# EAGLE design untitled (EAGLE 9.0.0)

## Sheet 1 of 2
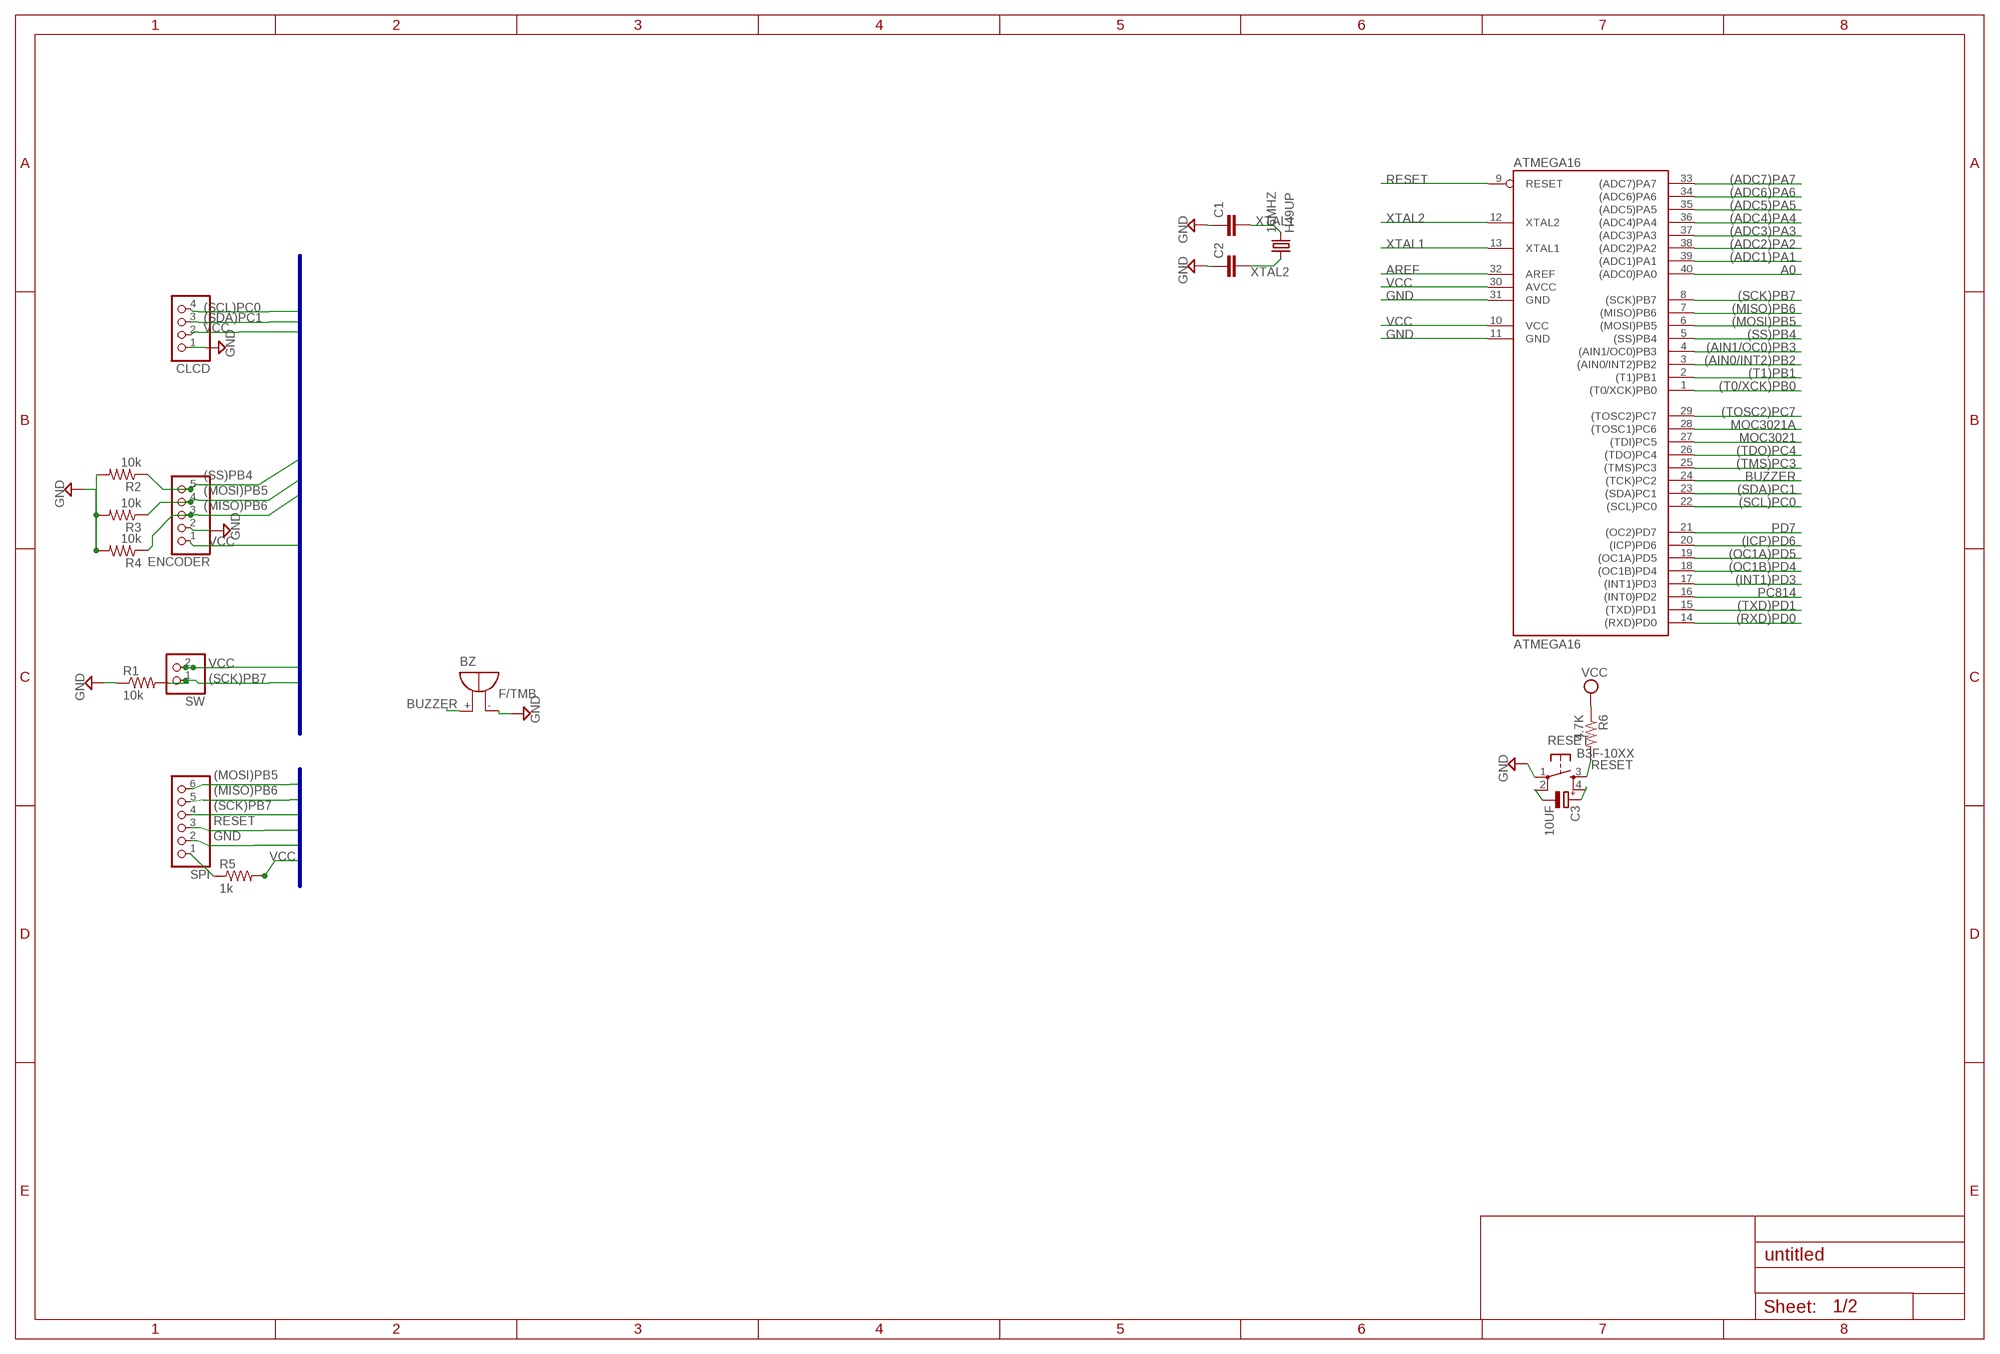
[diagram p0: schematic, sheet 1]

### Parts
16MHZ  H49UP  [XTAL1170X490X450N]
ATMEGA16  ATMEGA16  MEGA32-P  [DIL40]
BZ  F/TMB  [F/TMB]
C1  C-EU025-024X044  [C025-024X044]
C2  C-EU025-024X044  [C025-024X044]
C3  10UF  CPOL-EUE5-5  [E5-5]
CLCD  PINHD-1X4  [1X04]
ENCODER  PINHD-1X5  [1X05]
R1  10k  R-US_0204/7  [0204/7]
R2  10k  R-US_0204/7  [0204/7]
R3  10k  R-US_0204/7  [0204/7]
R4  10k  R-US_0204/7  [0204/7]
R5  1k  R-US_0204/7  [0204/7]
R6  4.7K  R-US_0204/7  [0204/7]
RESET  B3F-10XX  [B3F-10XX]
SPI  PINHD-1X6  [1X06]
SW  PINHD-1X2  [1X02]

### Nets
(ADC1)PA1: ATMEGA16.39((ADC1)PA1)
(ADC2)PA2: ATMEGA16.38((ADC2)PA2)
(ADC3)PA3: ATMEGA16.37((ADC3)PA3)
(ADC4)PA4: ATMEGA16.36((ADC4)PA4)
(ADC5)PA5: ATMEGA16.35((ADC5)PA5)
(ADC6)PA6: ATMEGA16.34((ADC6)PA6)
(ADC7)PA7: ATMEGA16.33((ADC7)PA7)
(AIN0/INT2)PB2: ATMEGA16.3((AIN0/INT2)PB2)
(AIN1/OC0)PB3: ATMEGA16.4((AIN1/OC0)PB3)
(ICP)PD6: ATMEGA16.20((ICP)PD6)
(INT1)PD3: ATMEGA16.17((INT1)PD3)
(MISO)PB6: ATMEGA16.7((MISO)PB6) ENCODER.3 R4.1 SPI.5
(MOSI)PB5: ATMEGA16.6((MOSI)PB5) ENCODER.4 R3.1 SPI.6
(OC1A)PD5: ATMEGA16.19((OC1A)PD5)
(OC1B)PD4: ATMEGA16.18((OC1B)PD4)
(RXD)PD0: ATMEGA16.14((RXD)PD0)
(SCK)PB7: ATMEGA16.8((SCK)PB7) R1.2 SPI.4 SW.1
(SCL)PC0: ATMEGA16.22((SCL)PC0) CLCD.4
(SDA)PC1: ATMEGA16.23((SDA)PC1) CLCD.3
(SS)PB4: ATMEGA16.5((SS)PB4) ENCODER.5 R2.1
(T0/XCK)PB0: ATMEGA16.1((T0/XCK)PB0)
(T1)PB1: ATMEGA16.2((T1)PB1)
(TDO)PC4: ATMEGA16.26((TDO)PC4)
(TMS)PC3: ATMEGA16.25((TMS)PC3)
(TOSC2)PC7: ATMEGA16.29((TOSC2)PC7)
(TXD)PD1: ATMEGA16.15((TXD)PD1)
A0: ATMEGA16.40((ADC0)PA0) ; also sheet 2
AREF: ATMEGA16.32(AREF)
BUZZER: ATMEGA16.24((TCK)PC2) BZ.+
GND: ATMEGA16.11(GND) ATMEGA16.31(GND) BZ.- C1.1 C2.1 CLCD.1 ENCODER.2 R1.1 R2.2 R3.2 R4.2 RESET.1(P) SPI.2 ; also sheet 2
MOC3021: ATMEGA16.27((TDI)PC5) ; also sheet 2
MOC3021A: ATMEGA16.28((TOSC1)PC6) ; also sheet 2
N$1: R5.1 SPI.1
N$2: C3.- RESET.2(P1)
N$3: C3.+ RESET.4(S1)
PC814: ATMEGA16.16((INT0)PD2) ; also sheet 2
PD7: ATMEGA16.21((OC2)PD7)
RESET: ATMEGA16.9(RESET) R6.2 RESET.3(S) SPI.3
VCC: ATMEGA16.10(VCC) ATMEGA16.30(AVCC) CLCD.2 ENCODER.1 R5.2 R6.1 SW.2 ; also sheet 2
XTAL1: 16MHZ.2 ATMEGA16.13(XTAL1) C1.2
XTAL2: 16MHZ.1 ATMEGA16.12(XTAL2) C2.2

### Buses
(MISO)PB6,(MOSI)PB5,(SCK)PB7,(SCL)PC0,(SDA)PC1,(SS)PB4,VCC
(MISO)PB6,(MOSI)PB5,(SCK)PB7,GND,RESET,VCC

## Sheet 2 of 2
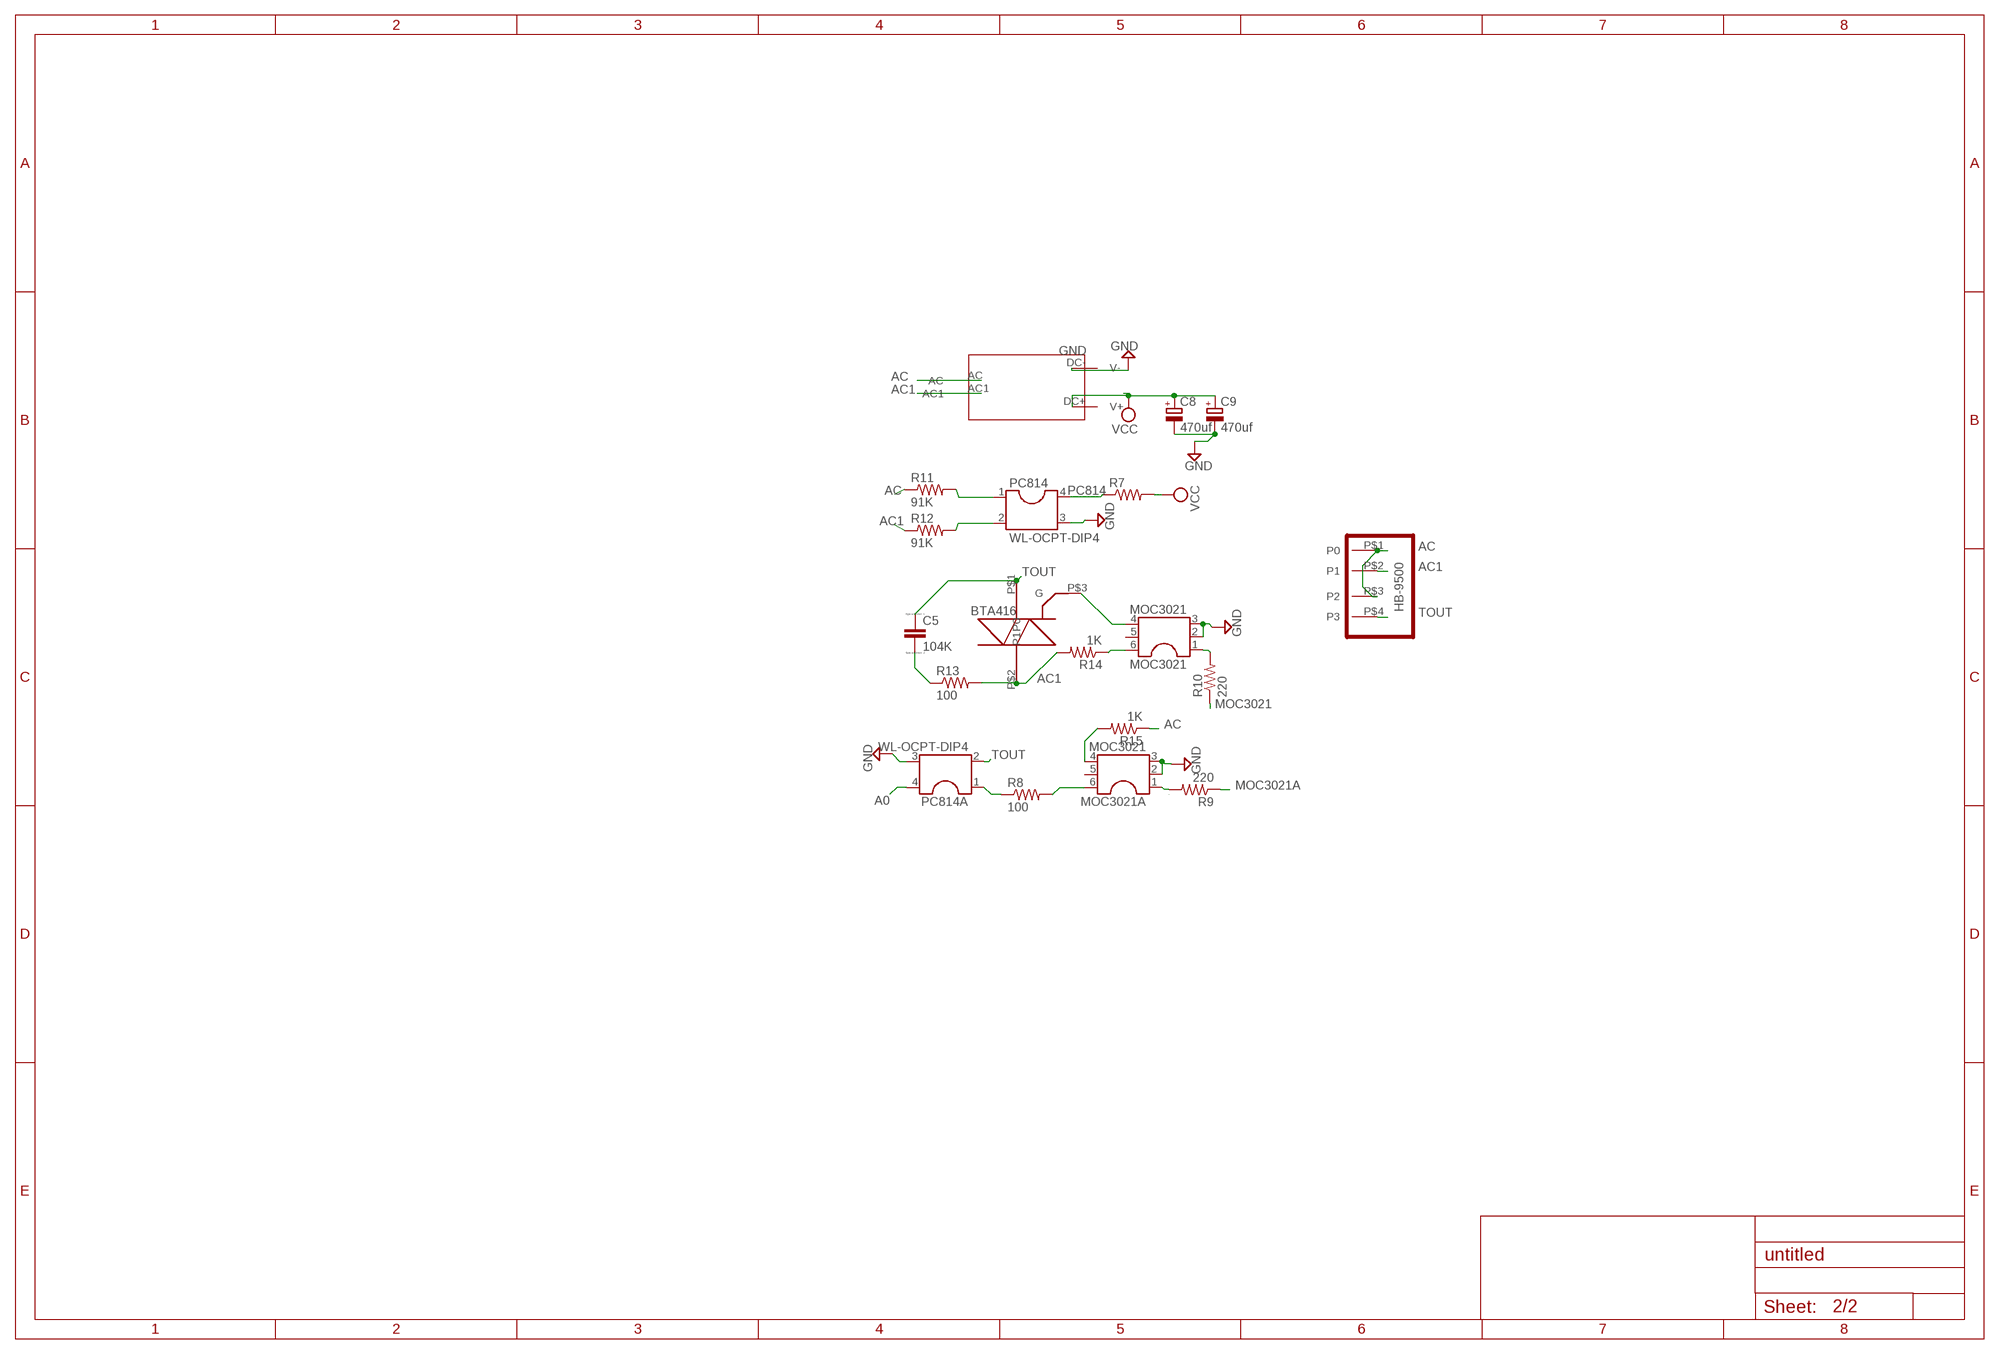
[diagram p1: schematic, sheet 2]

### Parts
BTA416  BT41600B  [BT41600B]
C5  104K  FTX_15X18X5X11  [WCAP-FTX2_15X18X5X11(PXLXWXH)]
C8  470uf  CAP-8,5  [CAPPRD508W65D800H1100B]
C9  470uf  CAP-8,5  [CAPPRD508W65D800H1100B]
HB-9500  HB-9500  [HB-9500]
MOC3021  MOC3021  [DIP889W53P254L940H300Q6B]
MOC3021A  MOC3021  [DIP889W53P254L940H300Q6B]
PC814  WL-OCPT-DIP4  [WL-OCPT_DIP4_STANDARD]
PC814A  WL-OCPT-DIP4  [WL-OCPT_DIP4_STANDARD]
R7  R-US_0204/7  [0204/7]
R8  100  R-US_0617/17  [0617/17]
R9  220  R-US_0204/7  [0204/7]
R10  220  R-US_0204/7  [0204/7]
R11  91K  R-US_0617/17  [0617/17]
R12  91K  R-US_0617/17  [0617/17]
R13  100  R-US_0617/17  [0617/17]
R14  1K  R-US_0617/17  [0617/17]
R15  1K  R-US_0617/17  [0617/17]
U$1  HLK-PM01  [HLK-PM01]

### Nets
A0: PC814A.4 ; also sheet 1
AC: HB-9500.P$1(P0) HB-9500.P$3(P2) R11.1 R15.1 U$1.AC
AC1: BTA416.P$2(P1) HB-9500.P$2(P1) R12.1 R13.2 R14.2 U$1.AC1
GND: C8.2(-) C9.2(-) MOC3021.2 MOC3021.3 MOC3021A.2 MOC3021A.3 PC814.3 PC814A.3 U$1.DC-(V-) ; also sheet 1
MOC3021: R10.1 ; also sheet 1
MOC3021A: R9.1 ; also sheet 1
N$4: MOC3021A.1 R9.2
N$6: PC814.1 R11.2
N$7: PC814.2 R12.2
N$9: C5.2 R13.1
N$11: BTA416.P$3(G) MOC3021.4
N$12: MOC3021.6 R14.1
N$13: MOC3021.1 R10.2
N$15: MOC3021A.4 R15.2
N$16: MOC3021A.6 R8.2
N$17: PC814A.1 R8.1
PC814: PC814.4 R7.1 ; also sheet 1
TOUT: BTA416.P$1(P0) C5.1 HB-9500.P$4(P3) PC814A.2
VCC: C8.1(+) C9.1(+) R7.2 U$1.DC+(V+) ; also sheet 1
Unconnected: MOC3021.5 MOC3021A.5

## Library data of the parts
16MHZ = XTAL1170X490X450N:H49UP
ATMEGA16 = atmel:MEGA32-P: MICROCONTROLLER 32 Kbytes FLASH 2 Kbytes SRAM 1 Kbytes EEPROM USART 8-channel 10 bit ADC Source: www.atmel.com .. doc2503.pdf; MPN: ATMEGA32-16PU; OC_FARNELL: 1661729; OC_NEWARK: 51P1794
BTA416 = BT41600B:BT41600B
BZ = buzzer:F/TMB: BUZZER Source: Buerklin; OC_FARNELL: unknown; OC_NEWARK: unknown
C1 C2 = rcl:C-EU: CAPACITOR, European symbol; SPICEPREFIX: C
C3 = resistor:CPOL-EU: POLARIZED CAPACITOR, European symbol
C5 = WCAP-FTX2_15X18X5X11(PXLXWXH):FTX_15X18X5X11
C8 C9 = CAP-8,5:CAP-8,5
CLCD = pinhead:PINHD-1X4: PIN HEADER
ENCODER = pinhead:PINHD-1X5: PIN HEADER
HB-9500 = HB-9500:HB-9500
MOC3021 MOC3021A = MOC3021:MOC3021
PC814 PC814A = WL-OCPT_DIP4_STANDARD:WL-OCPT-DIP4
R1-R15 = resistor:R-US_: RESISTOR, American symbol
RESET = B3F-10XX:B3F-10XX
SPI = pinhead:PINHD-1X6: PIN HEADER
SW = pinhead:PINHD-1X2: PIN HEADER
U$1 = HLK-PM01:HLK-PM01

## Board
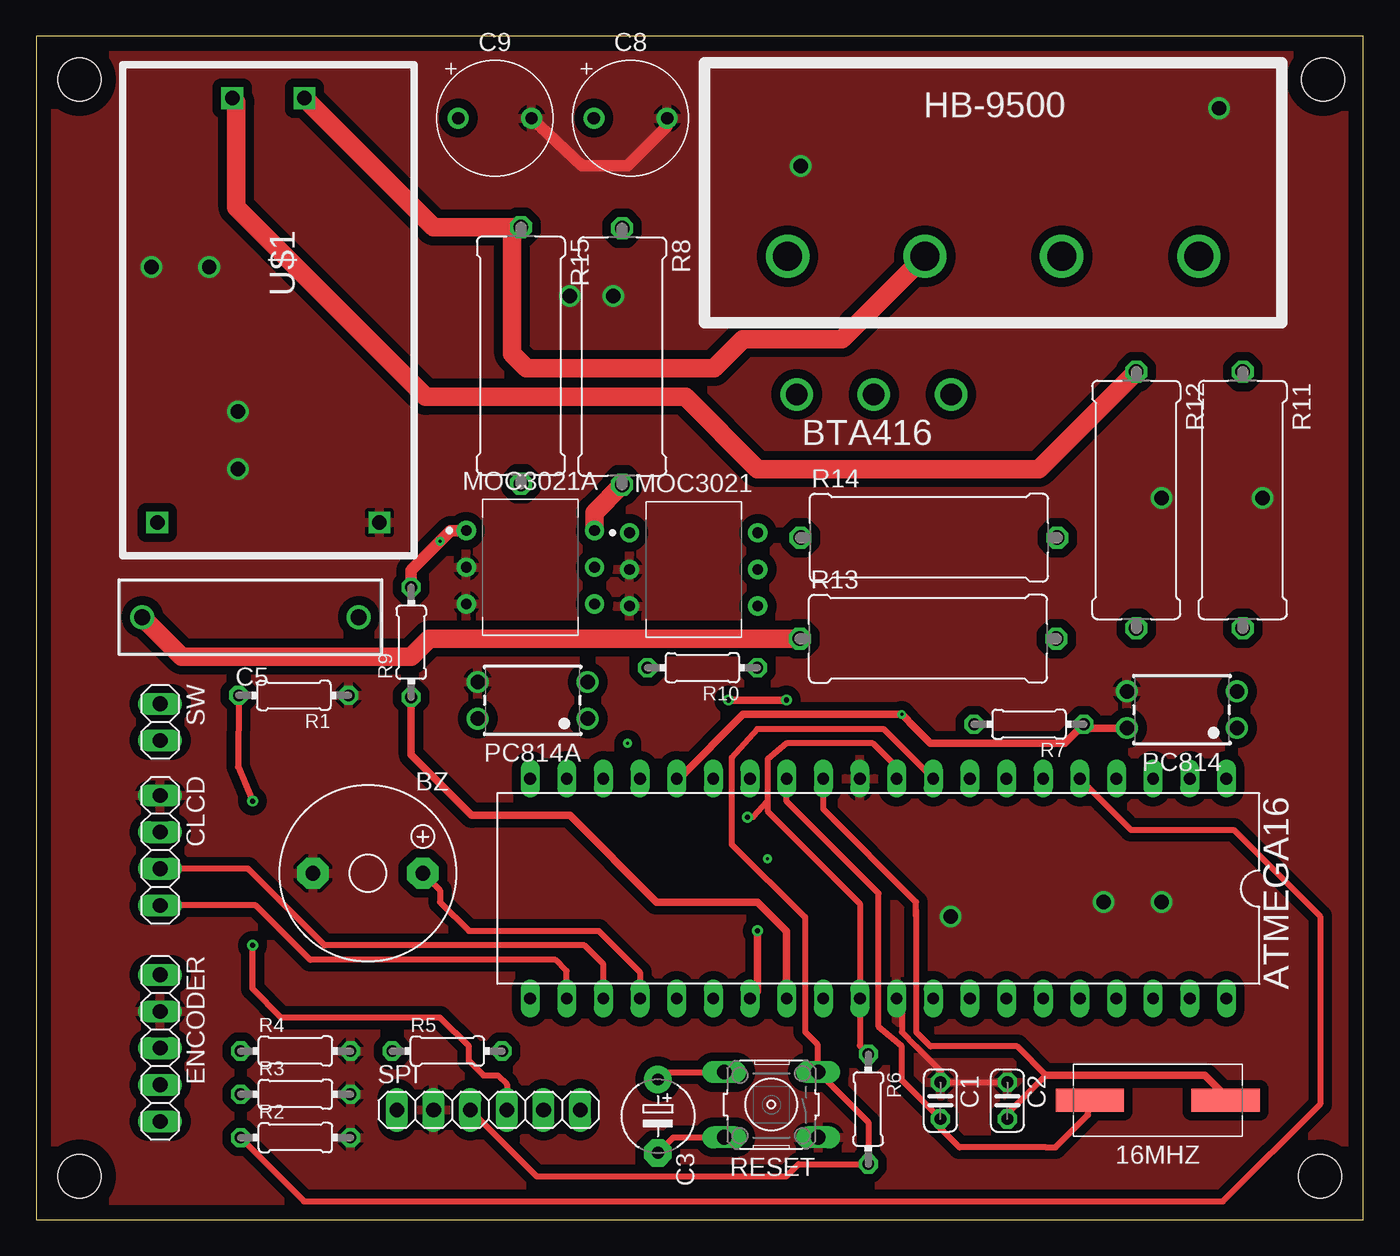
[diagram p2: board, top side]
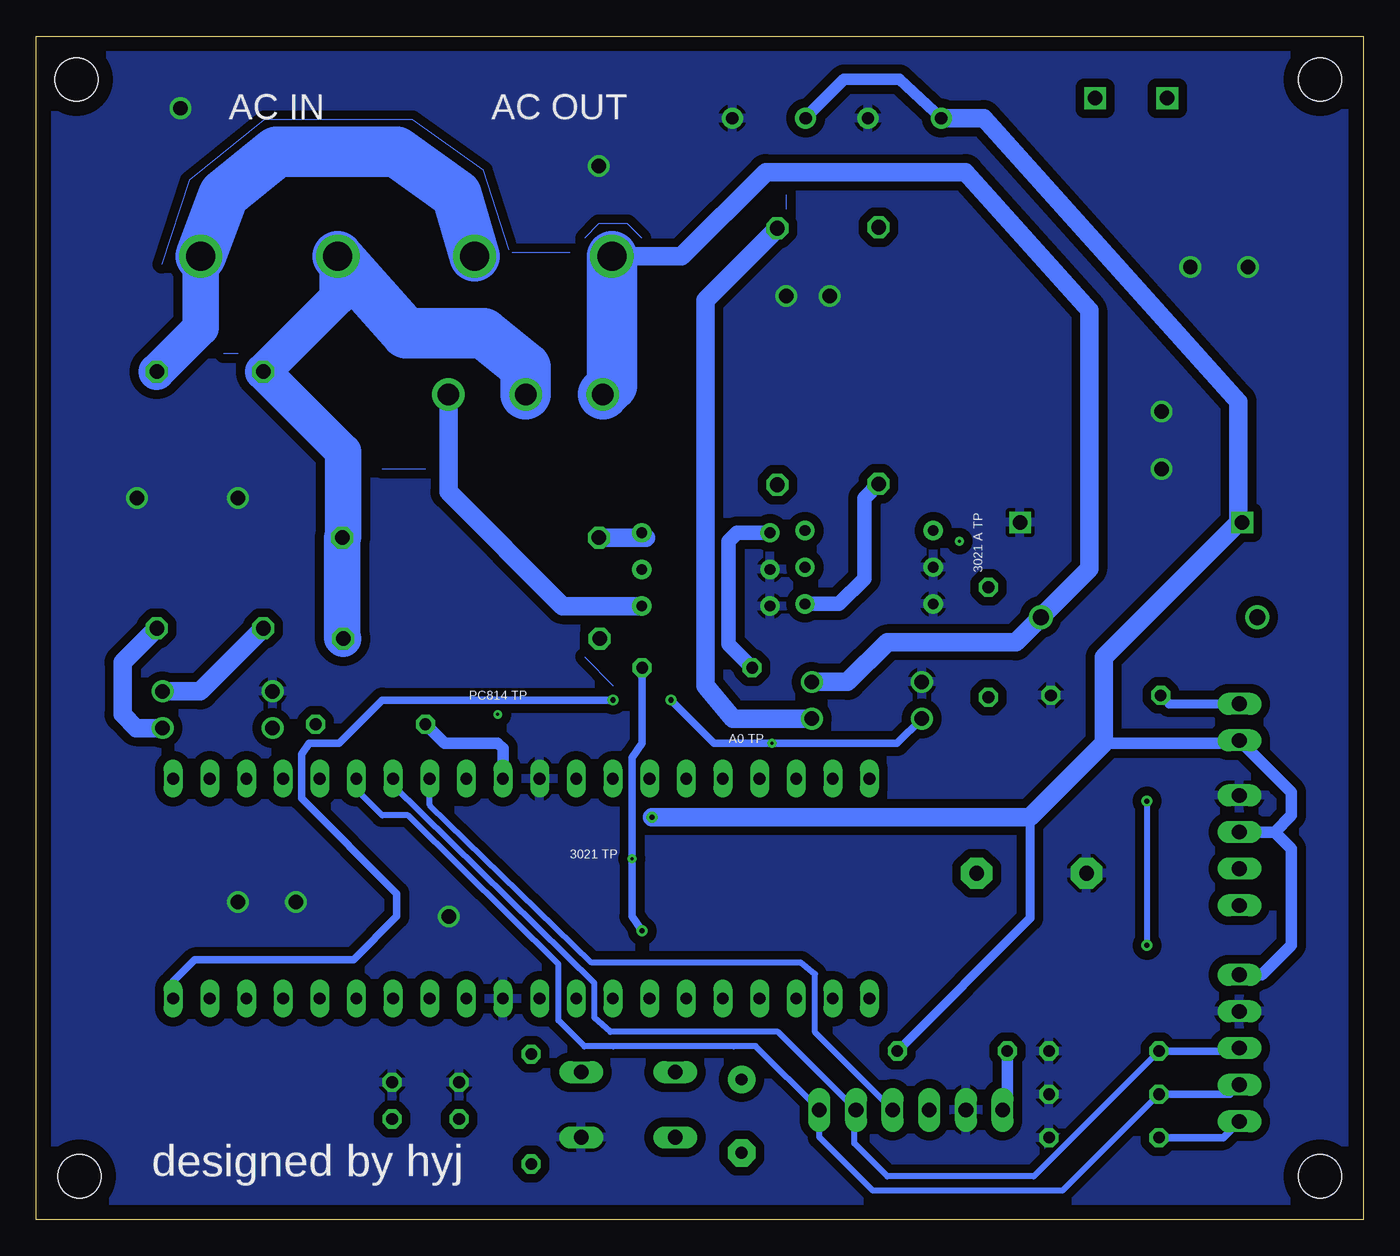
[diagram p3: board, bottom side, seen from below]

Size 92 x 82 mm. Coordinates in mm from the lower left corner, seen from the top.
Outline: 0,0 92,0 92,82 0,82 0,0
Copper layers (1*16): Top 0.035mm / dielectric 1.5mm / Bottom 0.035mm
Design rules "default": minimum track width 6mil, minimum drill 0.35mm, track to track 6mil, track to pad 6mil, pad to pad 6mil, via to via 6mil, smd to smd 6mil, copper to edge 40mil, drill to drill 6mil, minimum pad ring 10mil, minimum via ring 8mil, stop-mask expansion 4mil, vias tented up to drill 0mil, thermal gap 10mil
Holes 3 mm at 3,79 3,3 89.2,79 89,3

### Footprints (pad centres in the part's own frame; a part is rotated, then mirrored left to right if it is on the bottom)
XTAL1170X490X450N = smd 4.732 x 1.611: 1 -4.698,0; 2 4.698,0
DIL40 = drill 0.813 long: 1 -24.13,-7.62; 2 -21.59,-7.62; 3 -19.05,-7.62; 4 -16.51,-7.62; 5 -13.97,-7.62; 6 -11.43,-7.62; 7 -8.89,-7.62; 8 -6.35,-7.62; 9 -3.81,-7.62; 10 -1.27,-7.62; 11 1.27,-7.62; 12 3.81,-7.62; 13 6.35,-7.62; 14 8.89,-7.62; 15 11.43,-7.62; 16 13.97,-7.62; 17 16.51,-7.62; 18 19.05,-7.62; 19 21.59,-7.62; 20 24.13,-7.62; 21 24.13,7.62; 22 21.59,7.62; 23 19.05,7.62; 24 16.51,7.62; 25 13.97,7.62; 26 11.43,7.62; 27 8.89,7.62; 28 6.35,7.62; 29 3.81,7.62; 30 1.27,7.62; 31 -1.27,7.62; 32 -3.81,7.62; 33 -6.35,7.62; 34 -8.89,7.62; 35 -11.43,7.62; 36 -13.97,7.62; 37 -16.51,7.62; 38 -19.05,7.62; 39 -21.59,7.62; 40 -24.13,7.62
BT41600B = drill 1.5: P$1 2.66,-2; P$2 8,-2; P$3 13.36,-2
F/TMB = drill 1.016 pad 2.159 octagon: + 3.81,0; - -3.81,0
C025-024X044 = drill 0.813 octagon: 1 -1.27,0; 2 1.27,0
E5-5 = drill 0.813 pad 1.905: + -2.54,0 | drill 0.813 pad 1.905 octagon: - 2.54,0
WCAP-FTX2_15X18X5X11(PXLXWXH) = drill 1.1: 1 -7.5,0; 2 7.5,0
CAPPRD508W65D800H1100B = drill 0.85 pad 1.45: 1 -2.54,0; 2 2.54,0
1X04 = drill 1.016 long: 1 -3.81,0; 2 -1.27,0; 3 1.27,0; 4 3.81,0
1X05 = drill 1.016 long: 1 -5.08,0; 2 -2.54,0; 3 0,0; 4 2.54,0; 5 5.08,0
HB-9500 = drill 2: P$1 5.75,13.4; P$2 15.25,13.4; P$3 24.74,13.4; P$4 34.25,13.4
DIP889W53P254L940H300Q6B = drill 0.743 pad 1.343: 1 -4.445,2.54; 2 -4.445,0; 3 -4.445,-2.54; 4 4.445,-2.54; 5 4.445,0; 6 4.445,2.54
WL-OCPT_DIP4_STANDARD = drill 1: 1 -3.81,1.27; 2 -3.81,-1.27; 3 3.81,-1.27; 4 3.81,1.27
0204/7 = drill 0.813 octagon: 1 -3.81,0; 2 3.81,0
0617/17 = drill 1.016 octagon: 1 -8.89,0; 2 8.89,0
B3F-10XX = drill 1.016 long: 1 -3.251,2.261; 2 3.251,2.261; 3 -3.251,-2.261; 4 3.251,-2.261
1X06 = drill 1.016 long: 1 -6.35,0; 2 -3.81,0; 3 -1.27,0; 4 1.27,0; 5 3.81,0; 6 6.35,0
1X02 = drill 1.016 long: 1 -1.27,0; 2 1.27,0
HLK-PM01 = drill 1 square: AC 2.3,12.6; AC1 2.3,7.6; DC+ 31.7,2.4; DC- 31.7,17.8

### Placement (x,y rotation side)
16MHZ  77.74,8.26 180 top
ATMEGA16  58.37,22.93 180 top
BTA416  50.06,59.17 0 top
BZ  23,24 0 top
C1  62.68,8.24 270 top
C2  67.32,8.24 270 top
C3  43.1,7.17 270 top
C5  14.86,41.74 180 top
C8  41.2,76.31 0 top
C9  31.8,76.31 0 top
CLCD  8.6,25.58 270 top
ENCODER  8.6,11.88 270 top
HB-9500  86.34,80.14 180 top
MOC3021  45.58,45.05 0 top
MOC3021A  34.26,45.2 0 top
PC814  79.42,35.33 180 top
PC814A  34.42,35.98 180 top
R1  17.86,36.32 180 top
R2  17.98,5.68 0 top
R3  17.98,8.68 0 top
R4  17.98,11.68 0 top
R5  28.5,11.68 0 top
R6  57.68,7.66 270 top
R7  68.82,34.32 180 top
R8  40.63,59.8 270 top
R9  26,40 90 top
R10  46.18,38.24 180 top
R11  83.63,49.86 270 top
R12  76.25,49.86 270 top
R13  61.82,40.25 0 top
R14  61.88,47.25 0 top
R15  33.6,59.86 270 top
RESET  50.96,7.96 180 top
SPI  31.36,7.6 0 top
SW  8.6,34.47 270 top
U$1  6,80 270 top

### Tracks (layer width: path | path; a pad name or v marks a point on that pad's centre or on a via)
(MISO)PB6
  Bottom 0.406: SPI.5 35.28,7.71 | 35.28,7.71 40.57,13 52.2,13 53.3,14 53.3,16.39 67.26,30.11 ATMEGA16.7 | 35.28,6.29 35.28,7.71 | R4.1 22.85,3 33,3 35.28,5.29 35.28,7.71
  Bottom 0.508: R4.1 8.8,11.68 ENCODER.3
(MOSI)PB5
  Bottom 0.406: R3.1 20.85,2 34,2 37.71,5.71 SPI.6 42.13,12.02 43.64,12.02 43.66,12 52,12 54,12 55.8,13.8 55.8,17.7 66,27.8 66.2,28 68,28 69.8,29.8 ATMEGA16.6
  Bottom 0.508: R3.1 9.26,8.68 ENCODER.4
(SCK)PB7  (via drill 0.35)
  Top 0.406: R1.2 14,31.37 v15,29 | SPI.4 32.63,9.37 32,10 31,10 30,11 30,12 28,14 17,14 15,16 v15,19
  Bottom 0.406: SPI.4 38,12.97 38,17 39,17.8 43,17.8 53.5,17.8 64.72,28.72 ATMEGA16.8 | v15,29 v15,19
  Bottom 0.61: R1.2 13.47,35.74 SW.1
(SCL)PC0
  Top 0.406: ATMEGA16.22 36.78,17.22 36,18 19,18 15.23,21.77 CLCD.4
(SDA)PC1
  Top 0.406: ATMEGA16.23 39.32,17.68 38,19 20,19 14.69,24.31 CLCD.3
(SS)PB4
  Top 0.406: ATMEGA16.5 73.94,28.95 75.89,27 83,27 89,21 89,8 82.27,1.27 18.58,1.27 R2.1
  Bottom 0.508: R2.1 9.72,5.68 ENCODER.5
A0  (via drill 0.2, 0.35)
  Top 0.508: v52,36 v48,36
  Bottom 0.508: v52,36 68,36 71,33 73.06,33 73.6,32.25 73.6,29.19 67,22.59 67,21 70,18 81,18 82.5,16.5 ATMEGA16.40 | v48,36 45,33 v41,33 32.32,33 PC814A.4
AC
  Top 1.27: HB-9500.P$3 57.43,62.57 | 57.43,62.57 56.86,62 | 57.43,62.57 55.86,61 49,61 47,59 34,59 33,60 33,68.15 R15.1 27.55,68.75 U$1.AC
  Bottom 2.54: R11.1 80.59,61.79 HB-9500.P$1
  Bottom 3.5: HB-9500.P$3 62.86,71 67,74 75.33,74 79,71 HB-9500.P$1
AC1
  Top 1.27: R12.1 69.5,52 50,52 45,57 27,57 13.87,70.13 13.87,77.43 U$1.AC1
  Bottom 2.54: HB-9500.P$2 71.09,63.91 R12.1 70.71,53.21 70.71,47.31 R14.2 70.77,40.31 R13.2
  Bottom 3.5: HB-9500.P$2 66.35,61.4 61,61.4 58.06,59.06 BTA416.P$2
BUZZER
  Top 0.406: BZ.+ 28,22.81 28,22 30,20 39,20 41.86,17.14 ATMEGA16.24
GND  (via drill 1)
  Top 0.406: ATMEGA16.31 60,14.95 60,13 61,12 62.68,10.32 C1.1 C2.1
  Top 0.813: C9.2 37.85,73 41,73 43.74,75.74 C8.2
  other vias: 63.4,21 74,22 78,22 53,73 82,77 8,66 12,66 78,50 85,50 37,64 40,64 14,56 14,52
  pour Bottom (isolate 0.61): 0,82 0,0 92,0 92,82
  pour Top (isolate 0.61): 0,82 0,0 92,0 92,82
MOC3021  (via drill 0.35)
  Top 0.508: v50,20 50,15.83 ATMEGA16.27
  Bottom 0.508: R10.1 49.99,33.01 50.7,32 50.7,31.7 50.7,31.65 50.7,29.45 50.7,29.4 50.7,29 50.7,21 v50,20
MOC3021A
  Top 0.508: ATMEGA16.28 52.02,19.98 50,22 43,22 37,28 30.19,28 26,32.19 R9.1
N$1
  Bottom 0.813: R5.1 24.69,7.92 SPI.1
N$2
  Top 0.406: C3.- 44.17,5.7 RESET.2
N$3
  Top 0.406: C3.+ 43.61,10.22 RESET.4
N$4  (via drill 0.2)
  Top 0.813: R9.2 26,45 v28,47 28.74,47.74 MOC3021A.1
N$5  (via drill 0.2)
  other vias: 50.7,25
N$6
  Bottom 1.27: R11.2 86,38.6 86,35 85.06,34.06 PC814.1
N$7
  Bottom 1.27: R12.2 80.62,36.6 PC814.2
N$8
  Bottom 0.076: 59.2,67.2 61,72.7 65.9,76.2 76.2,76.2 81.4,72 83.3,66.2
N$9
  Top 1.27: R13.1 27.25,40.25 26,39 10.11,39 C5.2
N$10
  Bottom 0.076: 55,67 59,67
N$11
  Bottom 1.27: BTA416.P$3 63.42,50.42 55.51,42.51 MOC3021.4
N$12
  Bottom 1.27: MOC3021.6 49.73,47.25 R14.1
N$13
  Bottom 1.016: MOC3021.1 43.41,47.59 44,47 44,39.87 R10.2
N$14
  Bottom 0.076: 78,60 79,60
N$15
  Bottom 1.016: MOC3021A.4 36.34,42.66 34.6,44.4 34.6,49.97 R15.2
N$16
  Top 1.27: R8.2 38.7,48.98 MOC3021A.6
N$17
  Bottom 1.27: R8.1 45.6,63.7 45.6,37 43.71,34.71 PC814A.1
N$18
  Bottom 0.076: 50,68 51,69 53,69 54,68
N$19
  Bottom 0.076: 65,52 68,52
N$21
  Bottom 0.076: 40,70 40,71
N$23
  Bottom 0.076: 54,39 52,37
PC814  (via drill 0.2)
  Top 0.508: ATMEGA16.16 44.55,30.55 49,35 v60,35 60.94,34.06 62,33 71.31,33 R7.1 72.89,34.06 PC814.4
RESET
  Top 0.406: ATMEGA16.9 58.73,34 50,34 48.2,32 48.2,26 53.3,20.96 53.3,14.23 53.3,14.19 53.3,13 54.15,12.15 54.15,10.28 RESET.3 57.68,6.75 R6.2 52.85,3.85 52,3 34.69,3 SPI.3
TOUT
  Bottom 1.27: HB-9500.P$4 47.26,66.74 41.42,72.58 27.58,72.58 19,63 19,45.09 C5.1 24.09,40 33,40 35.75,37.25 PC814A.2
  Bottom 3.5: HB-9500.P$4 52.09,57.8 BTA416.P$1
VCC  (via drill 0.35)
  Top 0.406: ATMEGA16.10 59.64,31.36 58,33 52,33 50.7,31.9 50.7,29 | 50.7,29 49.69,27.89 v49.3,27.89 | ATMEGA16.30 57.1,14.45 | 50.7,29 50.7,28.3 57.1,21.9 ATMEGA16.30 | ATMEGA16.30 57.1,12.05 R6.1
  Bottom 0.61: 23.11,27.89 23.11,20.88 R5.2
  Bottom 0.813: R7.2 63.69,33 60,33 59.64,32.64 ATMEGA16.10 | C9.1 32.15,79 36,79 38.66,76.34 C8.1 | 18,33 8.8,33 SW.2 5,29.6 5,28 6.15,26.85 | CLCD.2 6.15,26.85 | 6.15,26.85 5,25.7 5,19 7.04,16.96 ENCODER.1
  Bottom 1.27: C9.1 26.31,76.31 8.67,56.67 8.67,48.57 | v49.3,27.89 23.11,27.89 18,33 18,38.96 8.67,48.29 8.67,48.57 | 8.67,48.57 U$1.DC+
XTAL1
  Top 0.406: 16MHZ.2 72.91,7.26 70.65,5 70,5 64,5 62.68,6.32 C1.2 60,9.65 60,12 58.4,13.38 58.4,22.6 52.02,28.98 ATMEGA16.13
XTAL2
  Top 0.406: C2.2 67.32,7.32 70,10 68,12 62,12 61,13 61,21 | 61,21.4 61,21 | 61,21 61,22 54.56,28.44 ATMEGA16.12
  Top 0.508: 16MHZ.1 82.57,8.43 81,10 70,10

### Text on the board
bPlace: AC OUT | AC IN | 3021 A TP | PC814 TP | A0 TP | 3021 TP | designed by hyj